# EAGLE board canSlaveV06 (EAGLE 7.1.0)
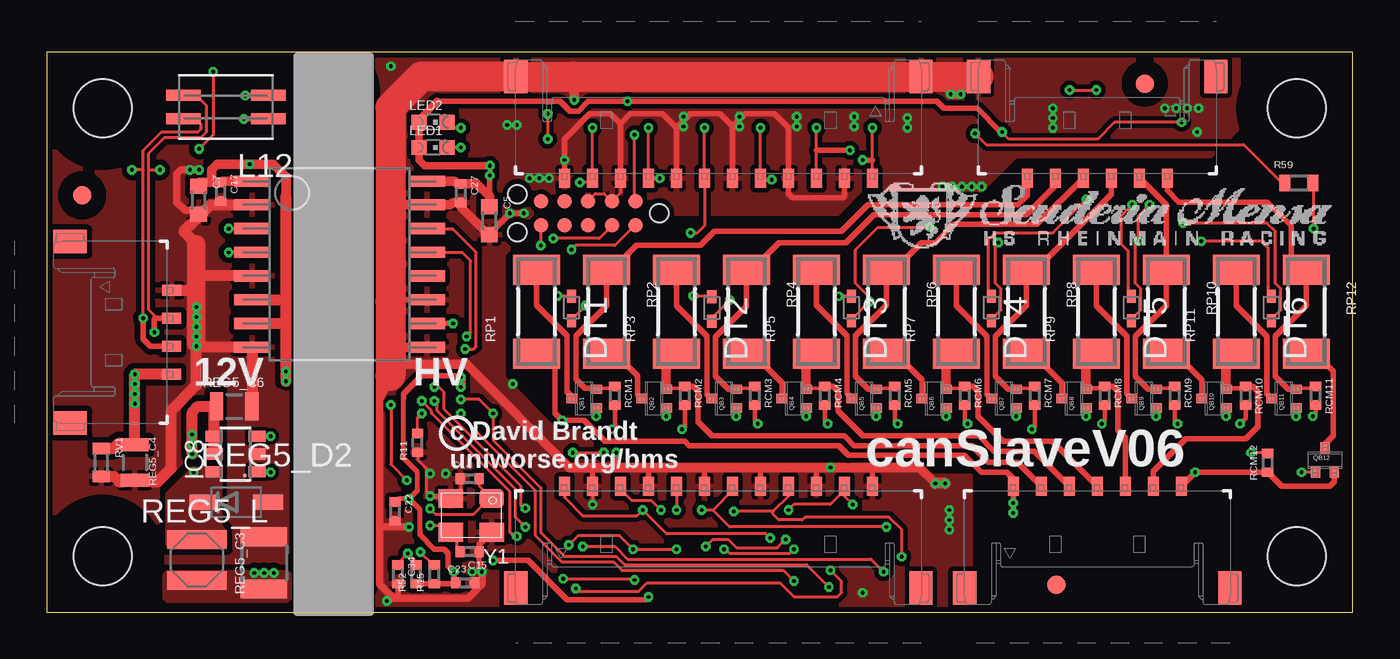
[diagram p7: board, top side]
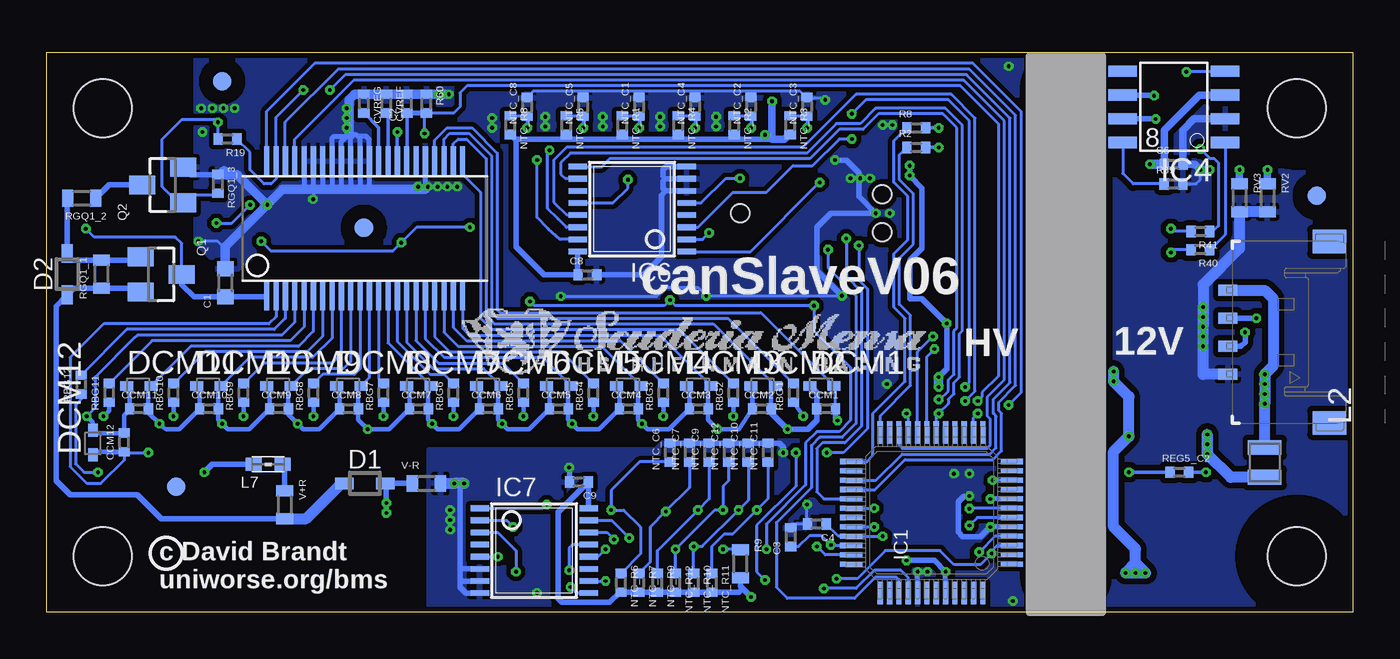
[diagram p8: board, bottom side, seen from below]

Size 70 x 30 mm. Coordinates in mm from the lower left corner, seen from the top.
Outline: 70,0 70,30 0,30 0,0 70,0
Copper layers (1*16): Top 0.035mm / dielectric 1.5mm / Bottom 0.035mm
Design rules "PCB-POOL Standard *": minimum track width 0.15mm, minimum drill 0.2mm, track to track 0.15mm, track to pad 0.15mm, pad to pad 0.15mm, via to via 0.15mm, smd to smd 0mil, copper to edge 0.3mm, drill to drill 0.2mm, minimum pad ring 0.2mm, minimum via ring 0.15mm, stop-mask expansion 0.075mm, vias tented up to drill 0.31mm, thermal gap 0.2mm
Holes 3.1 mm at 3,3 3,27 67,3 67,27
tRestrict: area 0,0 to 6,6; area 0,24 to 6,30; area 64,0 to 70,6; area 64,24 to 70,30; 1 lines
bRestrict: area 0,0 to 6,6; area 0,24 to 6,30; area 64,0 to 70,6; area 64,24 to 70,30; 1 lines

## Footprints (pad centres in the part's own frame; a part is rotated, then mirrored left to right if it is on the bottom)
C0603 = smd 0.8 x 0.9: 1 -0.75,0; 2 0.75,0
C0402 = smd 0.5 x 0.6: 1 -0.5,0; 2 0.5,0
SOD323-L = smd 1 x 0.6: A 1.1,0; C -1.1,0
TC2050-NL-JTORDER = smd 0.787 x 0.787: 1 -2.54,-0.635; 2 -2.54,0.635; 3 -1.27,-0.635; 4 -1.27,0.635; 5 0,-0.635; 6 0,0.635; 7 1.27,-0.635; 8 1.27,0.635; 9 2.54,-0.635; 10 2.54,0.635 | hole 0.991: 3.81,1.016; 3.81,-1.016; -3.81,0
SOD523 = smd 0.7 x 0.5: A 0.65,0; C -0.65,0
FIDUCIAL_1MM = smd 1 x 1: 1 0,0
LQFP48 = smd 0.28 x 1.2: 1 -2.75,-4.3; 2 -2.25,-4.3; 3 -1.75,-4.3; 4 -1.25,-4.3; 5 -0.75,-4.3; 6 -0.25,-4.3; 7 0.25,-4.3; 8 0.75,-4.3; 9 1.25,-4.3; 10 1.75,-4.3; 11 2.25,-4.3; 12 2.75,-4.3; 25 2.75,4.3; 26 2.25,4.3; 27 1.75,4.3; 28 1.25,4.3; 29 0.75,4.3; 30 0.25,4.3; 31 -0.25,4.3; 32 -0.75,4.3; 33 -1.25,4.3; 34 -1.75,4.3; 35 -2.25,4.3; 36 -2.75,4.3 | smd 1.2 x 0.28: 13 4.3,-2.75; 14 4.3,-2.25; 15 4.3,-1.75; 16 4.3,-1.25; 17 4.3,-0.75; 18 4.3,-0.25; 19 4.3,0.25; 20 4.3,0.75; 21 4.3,1.25; 22 4.3,1.75; 23 4.3,2.25; 24 4.3,2.75; 37 -4.3,2.75; 38 -4.3,2.25; 39 -4.3,1.75; 40 -4.3,1.25; 41 -4.3,0.75; 42 -4.3,0.25; 43 -4.3,-0.25; 44 -4.3,-0.75; 45 -4.3,-1.25; 46 -4.3,-1.75; 47 -4.3,-2.25; 48 -4.3,-2.75
44SSOP = smd 1.6 x 0.28: 1 -3.6,5.25; 2 -3.6,4.75; 3 -3.6,4.25; 4 -3.6,3.75; 5 -3.6,3.25; 6 -3.6,2.75; 7 -3.6,2.25; 8 -3.6,1.75; 9 -3.6,1.25; 10 -3.6,0.75; 11 -3.6,0.25; 12 -3.6,-0.25; 13 -3.6,-0.75; 14 -3.6,-1.25; 15 -3.6,-1.75; 16 -3.6,-2.25; 17 -3.6,-2.75; 18 -3.6,-3.25; 19 -3.6,-3.75; 20 -3.6,-4.25; 21 -3.6,-4.75; 22 -3.6,-5.25; 23 3.6,-5.25; 24 3.6,-4.75; 25 3.6,-4.25; 26 3.6,-3.75; 27 3.6,-3.25; 28 3.6,-2.75; 29 3.6,-2.25; 30 3.6,-1.75; 31 3.6,-1.25; 32 3.6,-0.75; 33 3.6,-0.25; 34 3.6,0.25; 35 3.6,0.75; 36 3.6,1.25; 37 3.6,1.75; 38 3.6,2.25; 39 3.6,2.75; 40 3.6,3.25; 41 3.6,3.75; 42 3.6,4.25; 43 3.6,4.75; 44 3.6,5.25
SO-8 = smd 1.524 x 0.61: 1 -2.743,1.905; 2 -2.743,0.635; 3 -2.743,-0.635; 4 -2.743,-1.905; 5 2.743,-1.905; 6 2.743,-0.635; 7 2.743,0.635; 8 2.743,1.905
SO16WB = smd 1.9 x 0.6: P$1 -4.7,4.445; P$2 -4.7,3.175; P$3 -4.7,1.905; P$4 -4.7,0.635; P$5 -4.7,-0.635; P$6 -4.7,-1.905; P$7 -4.7,-3.175; P$8 -4.7,-4.445; P$9 4.7,-4.445; P$10 4.7,-3.175; P$11 4.7,-1.905; P$12 4.7,-0.635; P$13 4.7,0.635; P$14 4.7,1.905; P$15 4.7,3.175; P$16 4.7,4.445
TSSOP16 = smd 0.305 x 0.991: 1 -2.275,-2.918; 2 -1.625,-2.918; 3 -0.975,-2.918; 4 -0.325,-2.918; 5 0.325,-2.918; 6 0.975,-2.918; 7 1.625,-2.918; 8 2.275,-2.918; 9 2.275,2.918; 10 1.625,2.918; 11 0.975,2.918; 12 0.325,2.918; 13 -0.325,2.918; 14 -0.975,2.918; 15 -1.625,2.918; 16 -2.275,2.918
SOT23-6 = smd 0.6 x 0.9: 1 -0.95,-1.15; 2 0,-1.15; 3 0.95,-1.15; 4 0.95,1.15; 5 0,1.15; 6 -0.95,1.15
WE-PMI_0806 = smd 0.8 x 1.8: 1 -0.8,0; 2 0.8,0
0603 = smd 0.85 x 0.7: 1 -0.775,0; 2 0.775,0
WE-SLM = smd 1.85 x 0.6: 1 -2.28,0.63; 2 -2.28,-0.62; 3 2.27,-0.62; 4 2.27,0.63
CHIPLED_0603 = smd 0.8 x 0.8: A 0,-0.75; C 0,0.75
R0402 = smd 0.5 x 0.6: 1 -0.5,0; 2 0.5,0
SOT23 = smd 1 x 1.4: 1 -0.95,-1.1; 2 0.95,-1.1; 3 0,1.1
SOT416 = smd 0.5 x 0.6: 1 -0.5,-0.65; 2 0.5,-0.65; 3 0,0.65
R0603 = smd 0.6 x 0.9: 1 -0.75,0; 2 0.75,0
C1210 = smd 1 x 2.5: 1 -1.4,0; 2 1.4,0
C0805 = smd 0.7 x 1.5: 1 -0.95,0; 2 0.95,0
SOD123 = smd 1.6 x 0.8: 1 -1.7,0; 2 1.7,0
WE-TPC_2828 = smd 3.2 x 1: 1 0,1.1; 2 0,-1.1
MINI_MELF-0207R = smd 1.6 x 2.5: 1 -2.25,0; 2 2.25,0
504050-0791 = smd 0.6 x 1: 1 -4.5,-0.25; 2 -3,-0.25; 3 -1.5,-0.25; 4 0,-0.25; 5 1.5,-0.25; 6 3,-0.25; 7 4.5,-0.25 | smd 1.25 x 1.8: P1 -7.105,5.2; P2 7.105,5.2
504050-0691 = smd 0.6 x 1: 1 -3.75,-0.25; 2 -2.25,-0.25; 3 -0.75,-0.25; 4 0.75,-0.25; 5 2.25,-0.25; 6 3.75,-0.25 | smd 1.25 x 1.8: P1 -6.355,5.2; P2 6.355,5.2
504050-0491 = smd 0.6 x 1: 1 -2.25,-0.25; 2 -0.75,-0.25; 3 0.75,-0.25; 4 2.25,-0.25 | smd 1.25 x 1.8: P1 -4.855,5.2; P2 4.855,5.2
504050-1291 = smd 0.6 x 1: 1 -8.25,-0.25; 2 -6.75,-0.25; 3 -5.25,-0.25; 4 -3.75,-0.25; 5 -2.25,-0.25; 6 -0.75,-0.25; 7 0.75,-0.25; 8 2.25,-0.25; 9 3.75,-0.25; 10 5.25,-0.25; 11 6.75,-0.25; 12 8.25,-0.25 | smd 1.25 x 1.8: P1 -10.855,5.2; P2 10.855,5.2
MT = smd 1.3 x 1: P1 -1.1,-0.9; P2 1.1,-0.9; P3 1.1,0.9; P4 -1.1,0.9

## Placement (x,y rotation side)
C1  100n,100V  [C0603]  60.42,17.64 90 bottom
C2  100n  [C0402]  50.7,27.25 90 bottom
C3  100n  [C0402]  30.12,4.03 90 bottom
C4  100n  [C0402]  28.73,4.72 180 bottom
C5  10u,10V,X7R  [C0603]  23.73,20.98 270 top
C6  100n,>10V,X7R  [C0402]  9.6,24 0 bottom
C7  10u,10V,X7R  [C0603]  8.15,22.07 270 top
C8  100n,>10V,X7R  [C0402]  41.02,18.07 0 bottom
C9  100n,>10V,X7R  [C0402]  41.48,6.97 180 bottom
C14  10p  [C0402]  22.68,7.15 0 top
C15  10p  [C0402]  22.68,3.25 180 top
C17  100n,>10V,X7R  [C0402]  9.32,22.52 270 top
C22  100n  [C0402]  18.68,5.4 270 top
C23  100n  [C0402]  22.43,1.57 0 top
C27  100n,>10V,X7R  [C0402]  22.2,22.45 270 top
C34  100n  [C0402]  18.82,2.02 270 top
CCM1  100n  [C0402]  28.23,10.9 0 bottom
CCM2  100n  [C0402]  31.68,10.9 0 bottom
CCM3  100n  [C0402]  35.05,10.9 0 bottom
CCM4  100n  [C0402]  38.8,10.9 0 bottom
CCM5  100n  [C0402]  42.55,10.9 0 bottom
CCM6  100n  [C0402]  46.3,10.9 0 bottom
CCM7  100n  [C0402]  50.05,10.9 0 bottom
CCM8  100n  [C0402]  53.8,10.9 0 bottom
CCM9  100n  [C0402]  57.55,10.9 0 bottom
CCM10  100n  [C0402]  61.3,10.9 0 bottom
CCM11  100n  [C0402]  65.05,10.9 0 bottom
CCM12  100n  [C0402]  65.85,9.1 90 bottom
CVREF  1u  [C0402]  51.8,27.25 270 bottom
CVREG  1u  [C0402]  53,27.25 270 bottom
D1  51V  [SOD323-L]  52.95,6.9 0 bottom
D2  12V  [SOD323-L]  68.89,18.11 90 bottom
DBG1  JTAG10-TC2050-NL  [TC2050-NL-JTORDER]  29.02,21.38 180 top
DCM1  7.5  [SOD523]  28.45,12.12 0 bottom
DCM2  7.5  [SOD523]  31.6,12.12 0 bottom
DCM3  7.5  [SOD523]  35.05,12.12 0 bottom
DCM4  7.5  [SOD523]  38.8,12.12 0 bottom
DCM5  7.5  [SOD523]  42.55,12.12 0 bottom
DCM6  7.5  [SOD523]  46.3,12.12 0 bottom
DCM7  7.5  [SOD523]  50.05,12.12 0 bottom
DCM8  7.5  [SOD523]  53.8,12.12 0 bottom
DCM9  7.5  [SOD523]  57.55,12.12 0 bottom
DCM10  7.5  [SOD523]  61.3,12.12 0 bottom
DCM11  7.5  [SOD523]  65.05,12.12 0 bottom
DCM12  7.5  [SOD523]  67.53,9.1 90 bottom
DT1  1PS79SB40  [SOD523]  28.12,16.27 270 top
DT2  1PS79SB40  [SOD523]  35.65,16.25 270 top
DT3  1PS79SB40  [SOD523]  43.12,16.27 270 top
DT4  1PS79SB40  [SOD523]  50.62,16.27 270 top
DT5  1PS79SB40  [SOD523]  58.12,16.27 270 top
DT6  1PS79SB40  [SOD523]  65.62,16.27 270 top
FID2  FIDUCIAL""  [FIDUCIAL_1MM]  1.91,22.33 0 top
FID3  FIDUCIAL""  [FIDUCIAL_1MM]  54.12,1.49 0 top
FID4  FIDUCIAL""  [FIDUCIAL_1MM]  58.85,28.32 0 top
FID7  FIDUCIAL""  [FIDUCIAL_1MM]  60.6,28.45 0 bottom
FID8  FIDUCIAL""  [FIDUCIAL_1MM]  1.95,22.31 0 bottom
FID9  FIDUCIAL""  [FIDUCIAL_1MM]  53,20.6 0 bottom
FID10  FIDUCIAL""  [FIDUCIAL_1MM]  63.05,6.72 0 bottom
IC1  LPC11C14  [LQFP48]  22.57,5.33 90 bottom
IC2  LTC6803-4  [44SSOP]  52.96,20.57 90 bottom
IC4  PCA82C251  [SO-8]  9.59,27.07 180 bottom
IC5  ADUM5201  [SO16WB]  15.7,18.65 0 top
IC6  4052-TSSOP16  [TSSOP16]  38.62,21.6 90 bottom
IC7  4052-TSSOP16  [TSSOP16]  43.88,3.3 270 bottom
IC8  LMR14203  [SOT23-6]  10.12,8.47 90 top
L2  WE-PMI/74479776233A  [WE-PMI_0806]  4.72,8.03 270 bottom
L7  WE-CBF,742792664  [0603]  58.13,7.92 0 bottom
L12  744242101  [WE-SLM]  9.6,27.07 180 top
LED1  GRN  [CHIPLED_0603]  20.7,24.9 270 top
LED2  RED  [CHIPLED_0603]  20.7,26.25 270 top
NTC_C1  1u  [C0402]  38.25,27.07 90 bottom
NTC_C2  1u  [C0402]  32.25,27.07 90 bottom
NTC_C3  1u  [C0402]  29.25,27.07 90 bottom
NTC_C4  1u  [C0402]  35.25,27.07 90 bottom
NTC_C5  1u  [C0402]  41.25,27.07 90 bottom
NTC_C6  1u  [C0402]  36.6,8.55 90 bottom
NTC_C7  1u  [C0402]  35.55,8.55 90 bottom
NTC_C8  1u  [C0402]  44.25,27.07 90 bottom
NTC_C9  1u  [C0402]  34.5,8.55 90 bottom
NTC_C10  1u  [C0402]  32.4,8.55 90 bottom
NTC_C11  1u  [C0402]  31.35,8.55 90 bottom
NTC_C12  1u  [C0402]  33.45,8.55 90 bottom
NTC_R1  10k  [R0402]  39.15,26.1 270 bottom
NTC_R2  10k  [R0402]  33.15,26.1 270 bottom
NTC_R3  10k  [R0402]  30.15,26.1 270 bottom
NTC_R4  10k  [R0402]  36.15,26.1 270 bottom
NTC_R5  10k  [R0402]  42.15,26.1 270 bottom
NTC_R6  10k  [R0402]  39.23,1.57 270 bottom
NTC_R7  10k  [R0402]  38.25,1.57 270 bottom
NTC_R8  10k  [R0402]  45.15,26.1 270 bottom
NTC_R9  10k  [R0402]  37.27,1.57 270 bottom
NTC_R10  10k  [R0402]  35.33,1.57 270 bottom
NTC_R11  10k  [R0402]  34.35,1.57 270 bottom
NTC_R12  10k  [R0402]  36.3,1.57 270 bottom
Q1  BSS84  [SOT23]  63.86,18.1 270 bottom
Q2  2N7002  [SOT23]  63.78,22.89 90 bottom
QB1  BSS84AKT  [SOT416]  28.8,11.45 90 top
QB2  BSS84AKT  [SOT416]  32.55,11.45 90 top
QB3  BSS84AKT  [SOT416]  36.3,11.45 90 top
QB4  BSS84AKT  [SOT416]  40.05,11.45 90 top
QB5  BSS84AKT  [SOT416]  43.8,11.45 90 top
QB6  BSS84AKT  [SOT416]  47.55,11.45 90 top
QB7  BSS84AKT  [SOT416]  51.3,11.45 90 top
QB8  BSS84AKT  [SOT416]  55.05,11.45 90 top
QB9  BSS84AKT  [SOT416]  58.8,11.45 90 top
QB10  BSS84AKT  [SOT416]  62.55,11.45 90 top
QB11  BSS84AKT  [SOT416]  66.3,11.45 90 top
QB12  BSS84AKT  [SOT416]  68.5,8.15 0 top
R2  1k  [R0402]  23.4,24.9 0 bottom
R8  1k  [R0402]  23.4,25.95 0 bottom
R9  3.3k  [R0603]  32.83,2.6 270 bottom
R11  10k  [R0402]  19.88,9.07 90 top
R15  10k  [R0402]  20.77,2.02 90 top
R19  4.7k  [R0402]  60.31,25.35 180 bottom
R39  0  [R0402]  9.61,22.95 0 bottom
R40  100  [R0402]  8.18,19.43 180 bottom
R41  100  [R0402]  8.18,20.4 180 bottom
R52  10k  [R0402]  19.8,2.02 90 top
R59  332k0.1%  [R0603]  67.1,23 0 top
R60  20k0.1%  [R0402]  49.65,27.25 270 bottom
RBG1  3.3k  [R0402]  29.98,11.75 90 bottom
RBG2  3.3k  [R0402]  33.2,11.75 90 bottom
RBG3  3.3k  [R0402]  36.95,11.75 90 bottom
RBG4  3.3k  [R0402]  40.7,11.75 90 bottom
RBG5  3.3k  [R0402]  44.45,11.75 90 bottom
RBG6  3.3k  [R0402]  48.2,11.75 90 bottom
RBG7  3.3k  [R0402]  51.95,11.75 90 bottom
RBG8  3.3k  [R0402]  55.7,11.75 90 bottom
RBG9  3.3k  [R0402]  59.45,11.75 90 bottom
RBG10  3.3k  [R0402]  63.2,11.75 90 bottom
RBG11  3.3k  [R0402]  66.65,11.75 90 bottom
RBG12  3.3k  [R0402]  68.15,12.2 90 bottom
RCM1  100  [R0402]  30.45,11.6 270 top
RCM2  100  [R0402]  34.2,11.6 270 top
RCM3  100  [R0402]  37.95,11.6 270 top
RCM4  100  [R0402]  41.7,11.6 270 top
RCM5  100  [R0402]  45.45,11.6 270 top
RCM6  100  [R0402]  49.2,11.6 270 top
RCM7  100  [R0402]  52.95,11.6 270 top
RCM8  100  [R0402]  56.7,11.6 270 top
RCM9  100  [R0402]  60.45,11.6 270 top
RCM10  100  [R0402]  64.25,11.6 270 top
RCM11  100  [R0402]  68,11.6 270 top
RCM12  100  [R0402]  65.42,8 90 top
REG5_C2  100n,>=25V,>=X5R  [C0402]  9.3,7.5 0 bottom
REG5_C3  47u,10V,X7R  [C1210]  11.65,2.65 90 top
REG5_C4  2.2u,50V,X7R  [C0805]  4.72,8.03 270 top
REG5_C6  2.2u,50V,X7R  [C0805]  10.05,11.03 0 top
REG5_D2  PMEG6010CEH  [SOD123]  10.18,5.9 0 top
REG5_L  744025100  [WE-TPC_2828]  8.05,2.8 0 top
RGQ1_1  1M,50V  [R0603]  67.07,18.11 90 bottom
RGQ1_2  100k,50V  [R0603]  68.11,22.18 180 bottom
RGQ1_3  1M  [R0402]  60.83,22.95 270 bottom
RP1  22  [MINI_MELF-0207R]  26.25,16.1 90 top
RP2  22  [MINI_MELF-0207R]  30,16.1 270 top
RP3  22  [MINI_MELF-0207R]  33.75,16.1 90 top
RP4  22  [MINI_MELF-0207R]  37.5,16.1 270 top
RP5  22  [MINI_MELF-0207R]  41.25,16.1 90 top
RP6  22  [MINI_MELF-0207R]  45,16.1 270 top
RP7  22  [MINI_MELF-0207R]  48.75,16.1 90 top
RP8  22  [MINI_MELF-0207R]  52.5,16.1 270 top
RP9  22  [MINI_MELF-0207R]  56.25,16.1 90 top
RP10  22  [MINI_MELF-0207R]  60,16.1 270 top
RP11  22  [MINI_MELF-0207R]  63.75,16.1 90 top
RP12  22  [MINI_MELF-0207R]  67.5,16.1 270 top
RV1  24V  [R0603]  2.92,8.03 270 top
RV2  24V  [R0603]  4.58,22.2 270 bottom
RV3  24V  [R0603]  6.08,22.2 270 bottom
U$3  [SMLOGOS_BSILK]  44.8,14.47 0 top
U$4  [SMLOGOS_SILK]  46.95,21.23 0 top
V+R  100  [R0603]  57.24,5.77 270 bottom
V-R  100  [R0603]  49.65,6.9 0 bottom
X1  504050-0791  [504050-0791]  56.3,6.5 180 top
X2  504050-0691  [504050-0691]  56.3,23.5 0 top
X3  504050-0491  [504050-0491]  6.45,15 90 top
X4  504050-0491  [504050-0491]  6.45,15 270 bottom
X5  504050-1291  [504050-1291]  36,23.5 0 top
X6  504050-1291  [504050-1291]  36,6.5 180 top
Y1  12Mhz  [MT]  22.75,5.19 180 top

## Tracks (layer width: path | path; a pad name or v marks a point on that pad's centre or on a via)
!RESET  (via drill 0.2)
  Top 0.15: C34.1 18.82,2.62 v19.35,3.15 19.8,2.7 R52.2 | DBG1.10 26.48,20.77 v26.48,19.65 | v28.2,8.55 v29.85,8.55 | v27.68,1.8 31.43,1.8 v31.5,1.73
  Bottom 0.15: IC1.3 19.07,3.58 19.35,3.3 v19.35,3.15 19.95,2.55 21.38,2.55 22.12,3.3 25.05,3.3 26.55,1.8 v27.68,1.8 | v26.48,19.65 26.48,17.77 26.02,17.32 26.02,9.82 27.3,8.55 v28.2,8.55 | v29.85,8.55 29.85,6.75 31.95,4.65 31.95,2.17 v31.5,1.73
+3V3  (via drill 0.2)
  Top 0.15: v60.83,26.25 57.23,26.25 56.33,25.35 51.58,25.35 v51.2,25.73 | DBG1.1 31.57,22.06 31.5,22.12 v31.5,25.57
  Top 0.27: v19.43,6.08 18.85,6.08 C22.1 | 21.82,1.68 C23.1 | 20,4.25 20,5.5 v19.43,6.08 | v19.43,6.08 19.88,6.53 19.88,7.5 19.12,8.25 19.12,11.47
  Top 0.3: v21.77,15.47 IC5.P$10 | v23.75,23.93 v23.75,23.4 23.73,23.3 C5.1 | v51.2,25.73 51.15,25.73 49.88,27 48.08,27 47.7,27.38 v31.12,27.38 29.02,27.38 28.5,26.85 28.05,26.85 27.52,27.38 20.93,27.38 | 19.12,11.47 19.12,11.7 20.1,12.68 22.12,12.68 v22.2,12.6 | 21.82,1.68 v21.82,2.17 21.52,2.48 21.52,3.15 21.3,3.38 20.77,3.38 20,4.15 20,4.25 | C23.1 21.88,1.52 R15.1 R52.1 | v23.93,2.77 25.8,2.77 27.9,0.68 32.1,0.68 v32.25,0.82
  Top 0.4: v23.75,23.93 20.25,23.93 19.95,24.23 LED1.A LED2.A 20,26.45 20.93,27.38
  Top 0.5: IC5.P$16 20.48,23.1 21.85,23.1 22,22.95 C27.1 23.05,22.95 23.73,22.27 C5.1 | v22.2,12.6 v22.2,12.07
  Bottom 0.15: RGQ1_3.2 60.85,22.45 60.95,22.35 62.28,22.35 Q2.1 62.94,21.94 63.8,22.8 63.8,25.35 62.75,26.4 60.98,26.4 v60.83,26.25 60.81,26.23 R19.2 | NTC_R3.2 30.2,25.6 30.38,25.43 | 44.9,25.35 NTC_R8.2 | NTC_R5.2 42.15,25.5 42.3,25.35 | NTC_R1.2 39.15,25.43 39.08,25.35 | NTC_R4.2 36.15,25.35 | NTC_R2.2 33.15,25.35 | 31.12,25.35 31.27,25.35 v31.5,25.57
  Bottom 0.2: IC2.30 51.21,25.57 v51.2,25.73 | 41.54,18.09 C8.1
  Bottom 0.27: IC1.8 v19.43,6.08 | IC1.44 v21.82,2.17
  Bottom 0.3: v22.2,12.6 21.75,13.05 21.75,15.45 v21.77,15.47 23.1,16.8 23.75,16.8 23.75,18.85 23.1,19.5 23.1,22.73 23.75,23.38 v23.75,23.4 v23.75,23.93 | v21.82,2.17 22.43,2.77 v23.93,2.77 | 31.12,25.35 33.15,25.35 36.15,25.35 39.08,25.35 42.3,25.35 44.9,25.35 | IC6.16 41.54,18.09 | C8.1 43.35,18.07 44.85,19.57 44.85,25.3 NTC_R8.2 | v32.25,0.82 32.7,1.27 | 32.7,1.27 32.83,1.4 R9.2 | IC7.16 40.96,5.92 40.95,5.92 40.95,6.95 C9.1 42.6,5.35 42.6,0.75 42.38,0.53 39.83,0.53 39.27,1.07 NTC_R6.2 NTC_R9.2 NTC_R7.2 NTC_R12.2 NTC_R10.2 NTC_R11.2 32.9,1.07 32.7,1.27
  Bottom 0.4: 30.38,25.43 30.45,25.35 31.12,25.35 v31.12,27.38
  Bottom 0.5: v22.2,12.07 v22.2,12.6
BAL1
  Bottom 0.15: IC2.25 48.71,25.34 48.4,25.65 47.35,25.65 46.15,24.45 46.15,16.05 45.85,15.75 33.48,15.75 RBG1.2
BAL2
  Bottom 0.15: IC2.23 47.71,23.46 46.75,22.5 46.75,15.75 46.15,15.15 36.1,15.15 RBG2.2
BAL3
  Bottom 0.15: IC2.21 48.21,15.26 47.5,14.55 39.25,14.55 RBG3.2
BAL4
  Bottom 0.15: IC2.19 49.21,14.76 48.4,13.95 42.4,13.95 RBG4.2
BAL5
  Bottom 0.15: IC2.17 50.21,14.56 49,13.35 45.55,13.35 RBG5.2
BAL6
  Bottom 0.15: IC2.15 51.21,14.51 49.45,12.75 48.7,12.75 RBG6.2
BAL7
  Bottom 0.15: IC2.13 52.21,12.51 RBG7.2
BAL8
  Bottom 0.15: IC2.11 53.21,13.04 53.5,12.75 55.2,12.75 RBG8.2
BAL9
  Bottom 0.15: IC2.9 54.21,13.84 54.7,13.35 58.35,13.35 RBG9.2
BAL10
  Bottom 0.15: IC2.7 55.21,14.79 56.05,13.95 61.5,13.95 RBG10.2
BAL11
  Bottom 0.15: IC2.5 56.21,15.29 56.95,14.55 64.35,14.55 RBG11.2
BAL12
  Bottom 0.15: IC2.3 57.21,15.74 57.8,15.15 65.7,15.15 RBG12.2
BOOST1  (via drill 0.2)
  Top 0.2: v12,7.5 11.3,7.5 IC8.1
  Bottom 0.2: REG5_C2.1 v12,7.5
C0  (via drill 0.2)
  Top 0.3: RP1.1 26.75,13.85 27.25,13.35 27.25,10.65 v27.62,10.28 28.8,10.28 29.93,9.15 34.2,9.15 34.42,8.93 42.45,8.93 42.98,8.4 49.2,8.4 50.1,7.5 51.45,7.5 51.8,7.15 X1.7 v51.8,5.85 v51.8,5.33
  Bottom 0.15: IC2.26 49.21,25.29 48.55,25.95 47.2,25.95 45.85,24.6 45.85,16.2 45.7,16.05 31.73,16.05 DCM1.A 27.73,12.05 CCM1.2
  Bottom 0.3: V-R.1 D1.A 51.8,6.85 v51.8,5.33 | CCM1.2 27.73,10.38 v27.62,10.28
C1
  Top 0.2: QB1.2 29.5,12 30.35,12 RCM1.1
  Top 0.3: RP2.1 30.3,18.35 31.6,19.65 35.05,19.65 35.8,20.4 42.6,20.4 44.02,21.82 52.05,21.82 52.55,22.32 X2.1 | RP2.1 30,17.9 | 29.5,12 28.85,12 28.38,12.47 28.38,14.8 30,16.43 RP2.1
C1M  (via drill 0.2)
  Top 0.25: RCM1.2 30.45,9.95 v30.3,9.8
  Bottom 0.15: IC2.24 48.21,25.09 47.95,25.35 47.5,25.35 46.45,24.3 46.45,15.9 46,15.45 34.27,15.45 DCM2.A
  Bottom 0.25: CCM2.2 31.18,11.97 DCM2.A
  Bottom 0.3: CCM2.2 31.18,10.68 v30.3,9.8 29.2,9.8 28.73,10.28 CCM1.1 28.73,11.75 DCM1.C
C2
  Top 0.2: QB2.2 33.25,12 34.1,12 RCM2.1
  Top 0.3: RCM2.1 34.65,12.1 34.9,11.85 34.9,10.2 35.65,9.45 42.75,9.45 43.27,8.93 49.58,8.93 50.48,8.03 52.02,8.03 X1.6
  Top 0.5: QB2.2 33.2,13.3 RP3.1
C2M  (via drill 0.2)
  Top 0.25: RCM2.2 34.2,9.95 v34.05,9.8
  Bottom 0.15: IC2.22 47.71,15.21 47.35,14.85 37.12,14.85 DCM3.A
  Bottom 0.25: DCM2.C 32.17,12.05 CCM2.1 32.9,9.8 v34.05,9.8 34.55,10.3 CCM3.2 34.55,11.97 DCM3.A
C3
  Top 0.2: QB3.2 37,12 37.85,12 RCM3.1
  Top 0.3: QB3.2 36.55,11.95 35.85,12.65 35.85,14.75 37.5,16.4 RP4.1 37.8,18.35 39.25,19.8 42.83,19.8 44.33,21.3 52.5,21.3 54.05,22.85 X2.2
C3M  (via drill 0.2)
  Top 0.25: RCM3.2 37.95,10.25 v38.1,10.1
  Bottom 0.15: IC2.20 48.71,15.01 47.95,14.25 40.27,14.25 DCM4.A
  Bottom 0.25: DCM3.C 35.55,11.97 CCM3.1 36.65,9.8 37.8,9.8 v38.1,10.1 38.3,10.3 CCM4.2 38.3,11.97 DCM4.A
C4
  Top 0.2: QB4.2 40.65,11.95 40.6,12 41.6,12 RCM4.1
  Top 0.3: RCM4.1 42.15,12.1 42.4,11.85 42.4,10.8 43.75,9.45 49.95,9.45 50.77,8.62 52.92,8.62 X1.5
  Top 0.5: QB4.2 40.7,13.3 RP5.1
C4M  (via drill 0.2)
  Top 0.25: RCM4.2 41.7,10.25 v41.85,10.1
  Bottom 0.15: IC2.18 49.71,14.66 48.7,13.65 43.42,13.65 DCM5.A
  Bottom 0.25: DCM4.C 39.3,11.97 CCM4.1 40.4,9.8 41.55,9.8 v41.85,10.1 42.05,10.3 CCM5.2 42.05,11.97 DCM5.A
C5
  Top 0.2: QB5.2 44.5,12 45.35,12 RCM5.1
  Top 0.3: QB5.2 44.05,11.95 43.35,12.65 43.35,14.8 45,16.45 RP6.1 45.45,18.35 45.45,18.38 46.88,19.8 47.62,19.8 48.6,20.77 53.08,20.77 X2.3
C5M  (via drill 0.2)
  Top 0.25: RCM5.2 45.45,10.25 v45.6,10.1
  Bottom 0.15: IC2.16 50.71,14.46 49.3,13.05 46.58,13.05 DCM6.A
  Bottom 0.25: DCM5.C 43.05,11.97 CCM5.1 44.15,9.8 45.3,9.8 v45.6,10.1 45.8,10.3 CCM6.2 45.8,11.97 DCM6.A
C6
  Top 0.2: QB6.2 48.25,12 49.1,12 RCM6.1
  Top 0.3: RCM6.1 49.65,12.1 49.9,11.85 49.9,10.5 51.25,9.15 53.9,9.15 X1.4
  Top 0.5: QB6.2 48.2,13.3 RP7.1
C6M  (via drill 0.2)
  Top 0.25: RCM6.2 49.2,10.25 v49.35,10.1
  Bottom 0.15: IC2.14 51.71,14.43 DCM7.A
  Bottom 0.25: DCM6.C 46.8,11.97 CCM6.1 47.9,9.8 49.05,9.8 v49.35,10.1 49.55,10.3 CCM7.2 49.55,11.97 DCM7.A
C7
  Top 0.2: QB7.2 52,12 52.85,12 RCM7.1
  Top 0.3: QB7.2 51.55,11.95 50.85,12.65 50.85,14.78 52.5,16.43 RP8.1 53,18.35 57.05,22.4 X2.4
C7M  (via drill 0.2)
  Top 0.25: RCM7.2 52.95,9.95 v52.8,9.8
  Bottom 0.15: IC2.12 52.71,12.57 DCM8.A
  Bottom 0.25: DCM7.C 50.55,11.97 CCM7.1 51.65,9.8 v52.8,9.8 53.3,10.3 CCM8.2 53.3,11.97 DCM8.A
C8
  Top 0.25: QB8.2 55.75,12 56.6,12 RCM8.1
  Top 0.3: RCM8.1 57.15,12.1 57.4,11.85 57.4,9.75 57.8,9.35 X1.3
  Top 0.5: QB8.2 55.7,13.3 RP9.1
C8M  (via drill 0.2)
  Top 0.25: RCM8.2 56.7,10.25 v56.55,10.1
  Bottom 0.15: IC2.10 53.71,13.44 54.1,13.05 55.98,13.05 DCM9.A
  Bottom 0.25: DCM8.C 54.3,11.97 CCM8.1 55.4,9.8 56.25,9.8 v56.55,10.1 57.05,10.6 CCM9.2 57.05,11.97 DCM9.A
C9
  Top 0.2: QB9.2 59.5,12 60.35,12 RCM9.1
  Top 0.3: QB9.2 59.05,11.95 58.35,12.65 58.35,14.78 60,16.43 RP10.1 60,21.82 58.58,23.25 X2.5
C9M  (via drill 0.2)
  Top 0.25: RCM9.2 60.45,10.25 v60.6,10.1
  Bottom 0.15: IC2.8 54.71,14.69 55.75,13.65 59.12,13.65 DCM10.A
  Bottom 0.25: DCM9.C 58.05,11.97 CCM9.1 59.15,9.8 60.3,9.8 v60.6,10.1 60.8,10.3 CCM10.2 60.8,11.97 DCM10.A
C10
  Top 0.25: RCM10.1 64.15,12 63.25,12 QB10.2
  Top 0.3: RCM10.1 64.65,12.1 64.9,11.85 64.9,9.9 64.88,9.9 64.28,9.3 61.05,9.3 59.3,7.55 X1.2
  Top 0.5: QB10.2 63.2,13.3 RP11.1
C10M  (via drill 0.2)
  Top 0.25: RCM10.2 64.25,10.4 v63.95,10.1
  Bottom 0.15: IC2.6 55.71,15.04 56.5,14.25 62.27,14.25 DCM11.A
  Bottom 0.25: DCM10.C 61.8,11.97 CCM10.1 62.9,9.8 63.6,9.8 64,10.05 v63.95,10.1 64.55,10.7 CCM11.2 64.55,11.97 DCM11.A
C11
  Top 0.2: QB11.2 67,12 67.9,12 RCM11.1
  Top 0.3: QB11.2 66.55,11.95 65.85,12.65 65.85,14.78 67.5,16.43 RP12.1 67.1,18.35 66.7,18.75 66.7,20.7 65.42,21.98 60.67,21.98 60.05,22.6 X2.6
C11M  (via drill 0.2)
  Top 0.25: RCM11.2 68,10.65 v67.85,10.5
  Bottom 0.15: IC2.4 56.71,15.54 57.4,14.85 65.12,14.85 65.28,14.72 67.4,12.6 67.4,10.95 v67.85,10.5
  Bottom 0.25: DCM11.C 65.55,11.97 CCM11.1 65.6,10.9 65.6,10.8 65.85,10.55 CCM12.2 67.38,9.6 DCM12.A 67.53,10.18 v67.85,10.5
C12  (via drill 0.2)
  Top 0.3: QB12.2 69,7 68.75,6.75 66.2,6.75 65.45,7.5 RCM12.1 v61.55,7.5 X1.1
  Bottom 0.3: L7.1 61.13,7.92 v61.55,7.5
C12FILT
  Bottom 0.3: V+R.1 57.24,7.81 L7.2
C12M  (via drill 0.2)
  Top 0.15: RCM12.2 65.55,8.5 65.6,8.55 v64.55,8.55
  Bottom 0.15: IC2.2 57.71,15.84 58.1,15.45 66.95,15.45 68.75,13.65 68.75,7.8 67.85,6.9 67.1,6.9 65.85,8.15 CCM12.1 65.9,8.6 65.95,8.55 | 66.8,8.55 65.95,8.55 | 65.95,8.55 v64.55,8.55
  Bottom 0.25: CCM12.1 67.38,8.6 DCM12.C
CANH  (via drill 0.2)
  Top 0.15: L12.4 7.98,26.45 8.25,26.18 8.25,25.88 8.1,25.73 6.15,25.73 5.17,24.75 5.17,23.7 | v5.17,15.75 5.17,23.7 | 5.17,23.7 v4.58,23.7
  Top 0.3: X3.2 5.55,14.25 5.17,14.62 v5.17,15.75
  Bottom 0.3: X4.2 v5.17,15.75
  Bottom 0.4: RV2.1 v4.58,23.7
CANL  (via drill 0.2)
  Top 0.15: L12.3 8.01,27.7 8.55,27.15 8.55,25.73 8.25,25.43 6.3,25.43 5.47,24.6 5.47,23.7 | 5.78,15.68 5.78,15.9 5.47,16.2 5.47,23.7 | 5.47,23.7 5.78,23.7 v6.08,23.7
  Top 0.3: X3.3 5.85,15.75 5.78,15.68 v5.78,15
  Bottom 0.3: X4.3 6,14.25 5.78,14.47 v5.78,15
  Bottom 0.4: RV3.1 v6.08,23.7
CANRX  (via drill 0.2)
  Top 0.15: v22.43,14.1 22.88,14.1 23.02,14.25 23.02,19.27 21.75,20.55 IC5.P$14
  Bottom 0.15: IC1.19 22.82,13.7 v22.43,14.1
CANTX  (via drill 0.2)
  Top 0.15: v22.5,14.78 22.73,15 22.73,18.82 22.27,19.29 IC5.P$13
  Bottom 0.15: IC1.20 23.32,13.95 v22.5,14.78
CAR+5V  (via drill 0.2)
  Top 0.15: IC8.3 v12,9.43
  Top 0.5: IC5.P$1 9.39,23.09 C17.1 8.78,23.02 | C7.1 8.15,23 8.18,23.02 8.78,23.02 | 12.82,22.27 12.82,23.32 12.15,24 v10.88,24 9.15,24 8.85,23.7 8.85,23.1 8.78,23.02
  Top 0.6: v12.82,12.38 12.82,15.45 | 12.82,15.45 12.82,16.8 | 12.82,16.8 12.82,22.27 | IC5.P$7 12.8,15.47 12.82,15.45 | IC5.P$6 12.77,16.75 12.82,16.8
  Bottom 0.4: C6.1 10.1,25.82 8.21,27.71 IC4.3
  Bottom 0.5: C6.1 v10.88,24
  Bottom 0.6: v11.12,2.1 v11.65,2.1 | v11.65,2.1 v12.18,2.1 12.18,2.12 11.65,2.65 | 11.65,2.65 11.1,2.1 v11.65,2.1 | v11.65,2.1 11.65,2.65 | 11.65,2.65 11.65,3.4 12.82,4.58 12.82,8.6 v12,9.43 12,11.55 v12.82,12.38 v12.82,12.9
  pour Top (rank 4, no thermals): 6.3,2.02 6.45,2.17 12.9,2.17 13.05,2.02 13.05,0.75 12.9,0.6 6.45,0.6 6.3,0.75
CAR_CANRX  (via drill 0.2)
  Top 0.15: IC5.P$3 10.51,20.55 10.5,20.55 v9.75,20.55
  Bottom 0.15: R41.2 9.6,20.4 v9.75,20.55
CAR_CANRX_T  (via drill 0.2)
  Top 0.15: v8.93,28.95 8.93,25.57 v8.18,24.82
  Bottom 0.15: IC4.4 7.32,28.98 7.35,28.95 v8.93,28.95 | R41.1 7.5,20.4 7.2,20.7 7.2,24.07 7.42,24.3 7.65,24.3 v8.18,24.82
CAR_CANTX  (via drill 0.2)
  Top 0.15: IC5.P$4 10.73,19.29 10.72,19.27 v9.75,19.27
  Bottom 0.15: R40.2 9.6,19.43 v9.75,19.27
CAR_CANTX_T
  Bottom 0.15: IC4.1 6.85,20.23 7.65,19.43 R40.1
CARGND  (via drill 0.2)
  Top 0.15: C17.2 9.32,21.93 9.22,21.82
  Top 0.4: 8.25,21.3 8.22,21.32 C7.2 7.95,21.52 7.42,21.52 6.97,21.98 6.97,23.48 7.2,23.7 v8.18,23.7 v7.67,23.7
  Top 0.6: IC5.P$2 9.22,21.82 8.78,21.82 8.25,21.3 7.35,20.4 8.03,19.73 | IC5.P$5 8.04,18.02 8.03,18 | 8.03,14.4 8.22,14.21 IC5.P$8 11,11.12 REG5_C6.2 | X3.4 8.03,17.25 8.03,16.88 | v8.03,15.82 v8.03,14.25 8.03,12.15 6.67,10.8 6.67,7.72 5.92,6.97 REG5_C4.2 3.9,6.97 3.6,7.28 RV1.2
  Top 1: 8.03,14.4 v8.03,14.78 v8.03,15.3 v8.03,15.82 v8.03,16.35 8.03,16.88 8.03,18 8.03,19.73
  Bottom 0.15: R39.2 8.4,22.95 8.18,23.18 v8.18,23.7
  Bottom 0.4: IC4.2 8.51,26.44 9.12,25.82 9.12,24.02 C6.2 8.47,24 v8.18,23.7 v7.67,23.7
  Bottom 0.6: X4.4 8.03,12.75 v8.03,15.3 | v8.03,15.3 v8.03,16.35 | RV2.2 RV3.2 6.08,19.5 8.03,17.55 v8.03,15.3
  pour Top (isolate 0.2, rank 6, no thermals): 13.12,11.85 13.05,11.93 9.82,11.93 9.75,11.85 9.75,4.95 10.05,4.65 10.05,3.38 10.2,3.23 12.97,3.23 13.12,3.38
  pour Top (isolate 0.3, rank 6): 0,0 13.05,0 13.05,30 0,30 0,0.07
  pour Bottom (isolate 0.3, rank 6): 0,0 13.05,0 13.05,30 0,30 0,0.07
CARVIN  (via drill 0.2)
  Top 0.6: X3.1 v4.72,12.75 REG5_C4.1 3.9,9.07 3.6,8.78 RV1.1
  Bottom 0.6: L2.1 v4.72,11.18 v4.72,11.7 v4.72,12.22 v4.72,12.75 4.28,13.2 4.28,16.8 4.72,17.25 X4.1
CARVINFILT  (via drill 0.2)
  Top 0.6: IC8.5 IC8.4 8.97,11 REG5_C6.1 8.1,11.03 7.8,10.72 v7.8,8.47
  Bottom 0.6: L2.2 6.55,7.22 v7.8,8.47 | v7.8,8.47 v7.8,9 v7.8,9.53 v7.8,8.47
CR1
  Top 0.3: QB1.3 28.15,11.55 27.9,11.8 27.9,14.8 26.25,16.45 RP1.2
CR2
  Top 0.3: QB2.3 31.88,11.45 31.68,11.65 31.68,12.68 31,13.35 30.5,13.35 RP2.2
CR3
  Top 0.3: QB3.3 35.6,11.45 35.4,11.65 35.4,14.78 33.75,16.43 RP3.2
CR4
  Top 0.3: QB4.3 39.4,12.3 37.85,13.85 RP4.2
CR5
  Top 0.3: QB5.3 43.15,11.47 42.9,11.72 42.9,14.8 41.25,16.45 RP5.2
CR6
  Top 0.3: QB6.3 46.9,12.45 45.5,13.85 RP6.2
CR7
  Top 0.3: QB7.3 50.62,11.45 50.4,11.68 50.4,14.78 48.75,16.43 RP7.2
CR8
  Top 0.3: QB8.3 54.4,12.3 52.85,13.85 RP8.2
CR9
  Top 0.3: QB9.3 57.9,11.7 57.9,14.78 56.25,16.43 RP9.2
CR10
  Top 0.3: QB10.3 61.9,12.45 60.5,13.85 RP10.2
CR11
  Top 0.3: QB11.3 65.4,11.7 65.4,14.78 63.75,16.43 RP11.2
CR12
  Top 0.3: QB12.3 68.5,9 68.95,9.45 68.95,12.9 68.35,13.5 67.85,13.5 RP12.2
FSM  (via drill 0.2)
  Top 0.15: v49.75,25.65 50.35,25.05 64.15,25.05 66.2,23 R59.1 | v25.2,4.08 25.02,4.08 24.82,4.28 24.82,6.45 20.62,10.65 20.62,10.8 v20.1,11.32
  Bottom 0.15: v49.75,25.65 49.75,26.65 R60.2 48.17,26.75 47.85,27.07 47.85,27.82 47.48,28.2 21.02,28.2 19,26.18 19,12.65 19.88,11.78 19.88,11.55 v20.1,11.32 | v25.2,4.08 IC1.33 27.57,4.08 C4.1
  Bottom 0.2: IC2.29 50.71,24.84 50.7,24.85 50.67,24.82 50.67,26.73 C2.1
  Bottom 0.27: C2.1 R60.2
GND  (via drill 0.2)
  Top 0.15: C23.2 23.25,1.57 23.32,1.65 | C22.2 18.6,4.9 IC1.5 | C14.1 22.18,6.61 Y1.P2 | R11.1 19.88,8.18 20.32,7.72 20.32,6.45 v20.55,6.22 | DT6.C 65.6,16.93 65.55,16.88 65.47,16.88 65.47,19.5 65.1,19.88 v61.88,19.88 | DT5.C 58.02,16.93 57.98,16.88 57.98,19.35 57.6,19.73 57.6,21.25 v58.17,21.82 | DT4.C 50.5,16.93 50.48,16.95 50.48,19.95 50.85,20.32 53.92,20.32 v55.73,22.12 | DT3.C v42.45,16.93 | v34.65,16.95 35.6,16.95 DT2.C | v27.38,16.95 28.1,16.95 DT1.C | X6.11 v29.25,5.78 | DBG1.5 29.02,22.05 29.4,22.43 29.88,22.43 DBG1.3 30.75,22.46 X5.3
  Top 0.3: X6.11 29.25,7.75 | X6.9 32.25,7.67 32.33,7.75 | X6.7 35.25,7.67 35.33,7.75 | X6.5 38.25,7.67 38.17,7.75 | X6.3 41.25,7.75 | X6.1 44.25,7.75 | v23.32,2.17 23.18,2.33 C15.1 23.18,3.61 Y1.P4 | Y1.P2 21.58,6.09 21.45,6.22 v20.55,6.22 | IC5.P$11 18.52,16.75 18.43,16.65 | C34.2 18.82,0.97 18.6,0.75 | C5.2 23.73,20.27 v24.82,21.38 v25.57,21.38 | X5.1 v27.75,24.23 27.75,25.35 29.1,26.7 30.23,26.7 30.75,26.18 | X5.3 30.75,26.18 | X5.5 33.75,25.95 | 33.75,25.95 33,26.7 31.27,26.7 30.75,26.18 | X5.7 36.75,26.02 | 36.75,26.02 36.08,26.7 34.5,26.7 33.75,25.95 | 36.75,26.02 37.42,26.7 39,26.7 39.75,25.95 X5.9 39.75,22.43 39.98,22.2 42.67,22.2 42.75,22.27 X5.11 | 30.52,7.75 v30.52,8.55
  Top 0.4: 18.43,12.65 17.9,11.45 17.85,12.53 17.85,4.58 | 17.85,4.58 17.85,1.5 18.6,0.75 22.57,0.75 23.32,1.5 23.32,1.65 v23.32,2.17 | 17.85,4.58 IC1.5 v19.43,4.58
  Top 0.5: C5.2 23.68,20.23 22.2,21.7 C27.2 21.75,21.95 21.62,21.82 IC5.P$15 18.62,21.82 17.95,21.15 17.95,14.1 | 18.55,13.28 18.1,12.15 18.18,12.75 18.5,12.43 18.43,12.65 | 18.55,13.28 17.95,13.5 17.95,14.1 | IC5.P$9 18.05,14.21 17.95,14.1 | v47.62,6.9 46.77,7.75 44.25,7.75 v42,7.75 41.25,7.75 38.17,7.75 35.33,7.75 32.33,7.75 30.52,7.75 29.25,7.75 28.02,7.75 22.5,13.28 18.55,13.28 | v48.98,27.75 v48.45,27.75 48.45,28.12 48.98,28.12 v48.98,27.75 | X2.P1 48.77,28.7 48.75,28.73 48.75,27.98 v48.98,27.75 | v28.27,27.45 28.27,28.62 28.2,28.7
  Top 0.6: v48.15,6.9 v47.62,6.9
  Top 1.6: 18.43,12.65 18.43,16.65 18.43,27.05 20.07,28.7 X5.P1 28.2,28.7 X5.P2 X2.P1
  Bottom 0.15: 60.42,19.58 60.53,19.58 60.83,19.88 v61.88,19.88 | 55.7,22.65 55.7,22.15 v55.73,22.12 | v42.45,16.93 37.3,16.93 36.83,17.4 35.1,17.4 v34.65,16.95 v27.38,16.95 | v29.25,5.78 29.25,4.72 C4.2 30.07,4.72 C3.2 | 32.17,27.9 29.62,27.9 29.3,27.57 NTC_C3.2 28.4,27.57 v28.27,27.45 | 32.17,27.9 35.25,27.9 | 35.25,27.9 38.17,27.9 | 38.17,27.9 41.25,27.9 | 41.25,27.9 43.92,27.9 NTC_C8.2 | NTC_C5.2 41.25,27.9 | NTC_C1.2 38.25,27.82 38.17,27.9 | NTC_C4.2 35.25,27.9 | NTC_C2.2 32.25,27.82 32.17,27.9
  Bottom 0.27: IC2.40 56.21,22.65 | 52.71,22.65 IC2.33 52.71,25.33 52.88,25.5 53.33,25.5 | IC2.39 55.71,22.66 55.7,22.65 | IC2.38 55.21,22.66 55.2,22.65 | 54.7,22.65 54.71,22.66 IC2.37 54.71,25.39 54.6,25.5 54,25.5 | 54.2,22.65 54.21,22.66 IC2.36 54.21,25.22 53.85,25.57 | 53.7,22.65 53.71,22.66 IC2.35 53.71,25.56 | 53.2,22.65 53.21,22.66 IC2.34 53.21,25.38 53.33,25.5 | IC2.27 49.71,22.65 | 53.33,25.5 53.4,25.57 53.7,25.57 | IC1.41 v23.32,2.17 | IC1.5 v19.43,4.58
  Bottom 0.3: RGQ1_3.1 62.29,23.45 Q2.2 | v20.55,6.22 20.85,6.22 21.15,5.92 21.15,4.28 20.93,4.05 19.95,4.05 v19.43,4.58 | C8.2 38.02,18.07 37.05,19.05 37.05,22.35 36.83,22.57 | 36.83,22.57 IC6.6 | IC6.7 36.85,23.23 | 36.85,23.23 36.98,23.1 36.98,22.73 36.83,22.57 | IC6.8 36.8,23.88 36.98,23.7 36.98,23.35 36.85,23.23 | v27.75,24.23 27.15,24.23 26.48,23.55 26.48,22.27 v25.57,21.38 27.98,21.38 28.73,20.62 28.73,18.3 v27.38,16.95 | NTC_C6.2 NTC_C7.2 NTC_C9.2 NTC_C12.2 NTC_C10.2 NTC_C11.2 30.73,9.05 30.52,8.85 v30.52,8.55 | IC7.8 47.52,1.02 47.85,1.35 47.85,1.8 | 47.85,1.8 47.85,2.33 | 47.85,2.33 47.85,6.67 v47.62,6.9 | IC7.7 47.73,1.68 47.85,1.8 | IC7.6 47.85,2.33 | C9.2 41.98,7.72 v42,7.75
  Bottom 0.5: 49.71,22.65 52.71,22.65 53.2,22.65 53.7,22.65 54.2,22.65 54.7,22.65 55.2,22.65 55.7,22.65 56.21,22.65 57.35,22.65 v58.17,21.82 | v58.17,21.82 60.42,19.58 C1.2 | RGQ1_3.1 60.33,23.45 59.8,23.45 v58.17,21.82 | 53.71,25.56 53.8,25.65 53.8,27.45 53.5,27.75 CVREG.1 CVREF.1 C2.2 R60.1 v48.98,27.75 v48.45,27.75
  Bottom 0.6: 60.5,23.62 60.33,23.45 | V-R.2 v48.15,6.9 v47.62,6.9
  other vias: 43.73,1.05 24.98,12.22 20.55,7.42 21.38,7.42 22.8,2.17 26.93,23.25 26.4,23.25 25.88,23.25 24.68,26.1 25.2,26.1 34.12,26.02 34.12,26.55 37.12,26.02 37.12,26.55 40.2,26.02 40.2,26.55 43.27,26.02 43.27,26.55 46.12,25.95 46.12,26.48 53.92,27 53.92,26.48 53.92,25.95 48,22.8 48.52,22.8 49.05,22.8 49.58,22.8 50.1,22.8 61.65,25.73 59.92,27 60.52,27 61.12,27 61.73,27 18.45,29.25 18.23,0.6 48.38,5.47 48.38,4.95 48.38,4.42
  pour Bottom (isolate 0.25, rank 6): 49.5,8.7 37.35,8.7 36.9,9.15 28.65,9.15 27.75,10.05 27.75,12.6 31.35,16.2 45.6,16.2 45.98,16.57 47.25,17.85 47.25,18.75 48.15,19.65 58.5,19.65 60,18.15 60.83,18.15 60.83,18.65 62,19.82 62,30 18,30 17.77,30 17.77,0 49.5,0
  pour Top (isolate 0.25, rank 6): 49.5,7.28 47.4,7.28 46.8,7.88 30.3,7.88 28.5,9.68 27.3,9.68 24.45,12.53 24.45,19.2 25.05,19.8 30.52,19.8 32.1,21.38 42.38,21.38 43.65,22.65 50.1,22.65 51.9,24.45 62.33,24.45 63.83,25.95 63.83,30 17.77,30 17.77,0 49.5,0
ISP_CAN  (via drill 0.2)
  Top 0.15: R11.2 19.88,10.43 v20.1,10.65
  Bottom 0.15: IC1.14 20.32,10.43 v20.1,10.65
ISP_ENTER  (via drill 0.2)
  Top 0.15: R15.2 20.73,2.52 v20.02,3.23
  Bottom 0.15: IC1.4 19.18,4.08 v20.02,3.23
LED1
  Bottom 0.15: IC1.24 25.32,10.53 23.7,12.15 23.7,15.9 24.3,16.5 24.3,18.98 23.55,19.73 23.55,22.43 24.3,23.18 24.3,24.5 R2.1
LED1C  (via drill 0.2)
  Top 0.2: LED1.C v22.2,24.9
  Bottom 0.2: R2.2 v22.2,24.9
LED2
  Bottom 0.15: IC1.25 26.05,8.07 25.73,8.4 25.73,10.65 24,12.38 24,15.75 24.6,16.35 24.6,19.2 23.85,19.95 23.85,22.27 24.6,23.02 24.6,25.25 R8.1
LED2C  (via drill 0.2)
  Top 0.2: LED2.C 21.45,26.02 21.52,25.95 v22.2,25.95
  Bottom 0.2: R8.2 v22.2,25.95
MISO0  (via drill 0.2)
  Top 0.15: v54.83,27.98 v56.25,27.98
  Bottom 0.15: IC1.27 25.55,7.08 24.15,8.47 19.45,8.47 19.12,8.8 19.12,10.5 19.27,10.65 19.27,11.4 18.38,12.3 18.38,26.48 20.7,28.8 54,28.8 v54.83,27.98 | R19.1 59.1,24.64 59.1,23.7 58.35,22.95 57.98,22.95 57.71,23.22 IC2.43 57.71,26.52 v56.25,27.98
MOSI0
  Bottom 0.15: IC1.28 25.6,6.58 24,8.18 19.3,8.18 18.82,8.65 18.82,10.65 18.98,10.8 18.98,11.25 18.07,12.15 18.07,26.62 20.55,29.1 54.38,29.1 57.21,26.27 IC2.42
N$2  (via drill 0.2)
  Top 0.3: L12.1 10.57,26.45 v10.57,26.43
  Bottom 0.3: IC4.7 v10.57,26.44 v10.57,26.43
N$6  (via drill 0.2)
  Top 0.3: L12.2 10.65,27.7 v10.65,27.68
  Bottom 0.3: IC4.6 10.65,27.71 v10.65,27.68
Q1G
  Bottom 0.3: Q1.1 64.99,18.86 RGQ1_1.2 68.69,18.86 D2.A 68.89,22.15 RGQ1_2.2
Q1GR
  Bottom 0.3: Q2.3 66.65,22.89 RGQ1_2.1
QBG1  (via drill 0.2)
  Top 0.25: QB1.1 v29.45,10.5
  Bottom 0.25: RBG1.1 v29.45,10.5
QBG2  (via drill 0.2)
  Top 0.25: QB2.1 v33.2,10.5
  Bottom 0.25: RBG2.1 v33.2,10.5
QBG3  (via drill 0.2)
  Top 0.25: QB3.1 v36.95,10.5
  Bottom 0.25: RBG3.1 v36.95,10.5
QBG4  (via drill 0.2)
  Top 0.25: QB4.1 v40.7,10.5
  Bottom 0.25: RBG4.1 v40.7,10.5
QBG5  (via drill 0.2)
  Top 0.25: QB5.1 v44.45,10.5
  Bottom 0.25: RBG5.1 v44.45,10.5
QBG6  (via drill 0.2)
  Top 0.25: QB6.1 v48.2,10.5
  Bottom 0.25: RBG6.1 v48.2,10.5
QBG7  (via drill 0.2)
  Top 0.25: QB7.1 v51.95,10.5
  Bottom 0.25: RBG7.1 v51.95,10.5
QBG8  (via drill 0.2)
  Top 0.25: QB8.1 v55.7,10.5
  Bottom 0.25: RBG8.1 v55.7,10.5
QBG9  (via drill 0.2)
  Top 0.25: QB9.1 v59.45,10.5
  Bottom 0.25: RBG9.1 v59.45,10.5
QBG10  (via drill 0.2)
  Top 0.25: QB10.1 v63.2,10.5
  Bottom 0.25: RBG10.1 v63.2,10.5
QBG11  (via drill 0.2)
  Top 0.25: QB11.1 v66.95,10.5
  Bottom 0.25: RBG11.1 66.65,10.8 v66.95,10.5
QBG12  (via drill 0.2)
  Top 0.15: QB12.1 v67.25,7.5
  Bottom 0.15: RBG12.1 68.15,11.4 68.45,11.1 68.45,7.95 QB12.1 v67.25,7.5
RS1
  Bottom 0.15: R39.1 11.77,22.95 12.33,23.51 IC4.8
SCK0
  Bottom 0.15: IC1.22 24.32,8.95 24.15,8.78 19.6,8.78 19.43,8.95 19.43,10.35 19.57,10.5 19.57,11.55 18.68,12.45 18.68,26.32 20.85,28.5 53.55,28.5 56.71,25.34 IC2.41
SSEL0  (via drill 0.2)
  Top 0.15: v18.45,11.1 18.45,7.92 v19.3,7.08
  Bottom 0.15: v18.45,11.1 17.77,11.78 17.77,26.82 20.35,29.4 55.65,29.4 58.21,26.84 IC2.44 | IC1.10 v19.3,7.08
SW1  (via drill 0.2)
  Bottom 0.2: REG5_C2.2 v7.88,7.5
  pour Top (rank 5, no thermals): 8.62,7.72 9.32,7.72 9.32,4.62 9.6,4.35 9.6,3.6 9.45,3.45 6.6,3.45 6.45,3.6 6.45,6.38 7.8,7.72
SWCLK  (via drill 0.2)
  Top 0.15: DBG1.4 30.3,20.7 29.62,20.02 v27.15,20.02
  Bottom 0.15: v27.15,20.02 27.15,18 26.32,17.18 26.32,9.97 27.23,9.07 28.43,9.07 28.73,8.78 28.73,6.45 28.35,6.08 IC1.29
SWDIO  (via drill 0.2)
  Top 0.15: DBG1.2 31.54,20.74 30.45,19.65 28.35,19.65 v28.12,19.43
  Bottom 0.15: IC1.39 24.32,1.75 24.45,1.88 25.57,1.88 26.7,0.75 30.3,0.75 30.9,1.35 30.9,4.8 29.02,6.67 29.02,8.93 28.57,9.38 27.38,9.38 26.62,10.12 26.62,16.95 28.12,18.45 v28.12,19.43
TEMP0  (via drill 0.2)
  Top 0.15: v29.25,25.95 X5.2 29.25,23.1 29.18,23.02 v28.57,23.02
  Bottom 0.15: v29.25,25.95 NTC_C3.1 30.12,26.57 NTC_R3.1 | IC6.1 32.27,19.32 v28.57,23.02
TEMP1  (via drill 0.2)
  Top 0.15: v32.25,25.95 X5.4 v32.85,23.25
  Bottom 0.15: v32.25,25.95 NTC_C2.1 32.27,26.6 NTC_R2.1 | IC6.5 34.92,21.93 33.6,23.25 v32.85,23.25
TEMP2  (via drill 0.2)
  Top 0.15: v35.25,25.95 X5.6 35.25,20.7 34.88,20.32 v34.5,20.32
  Bottom 0.15: v35.25,25.95 NTC_C4.1 36.12,26.57 NTC_R4.1 | IC6.2 34.85,19.98 v34.5,20.32
TEMP3  (via drill 0.2)
  Top 0.15: v38.25,25.95 X5.8 38.17,23.18 v38.85,23.18
  Bottom 0.15: v38.25,25.95 NTC_C1.1 39.12,26.57 NTC_R1.1 | IC6.12 39.65,21.93 38.85,22.73 v38.85,23.18
TEMP4  (via drill 0.2)
  Top 0.15: X5.10 41.25,24.75 v41.25,25.95
  Top 0.3: v43.05,24.75 41.25,24.75
  Bottom 0.15: v41.25,25.95 NTC_C5.1 42.12,26.57 NTC_R5.1 | IC6.14 42.15,20.62 42.6,21.07 43.15,21.62 43.15,24.65 v43.05,24.75
TEMP5  (via drill 0.2)
  Top 0.15: X5.12 44.25,24.23 v44.25,25.95
  Top 0.3: 44.25,24.23 v43.73,24.23
  Bottom 0.15: v44.25,25.95 NTC_C8.1 45.12,26.57 NTC_R8.1 | IC6.15 42.48,19.98 43.12,20.55 43.73,21.15 v43.73,24.23
TEMP6  (via drill 0.2)
  Top 0.15: v43.2,5.78 42.75,6.22 X6.2 42.75,6.53 42,5.78 40.05,5.78 v39.75,5.47
  Bottom 0.15: IC7.1 43.4,5.58 v43.2,5.78 | NTC_C6.1 38.23,8.05 39.75,6.53 v39.75,5.47 39.08,5.47 38.17,4.58 38.17,3.12 NTC_R6.1
TEMP7  (via drill 0.2)
  Top 0.15: X6.4 39.75,6.22 38.92,5.4 | 38.92,5.4 v36.83,5.4 | v45.83,2.98 45.83,4.42 45.15,5.1 40.65,5.1 40.5,4.95 39.23,4.95 38.92,5.25 38.92,5.4
  Bottom 0.15: NTC_C7.1 35.55,6.67 v36.83,5.4 37.65,4.58 37.65,2.7 38.25,2.1 NTC_R7.1 | IC7.5 v45.83,2.98
TEMP8  (via drill 0.2)
  Top 0.15: X6.6 36.75,6.53 35.7,5.47 | 35.7,5.47 v35.1,5.47 | v45,4.58 36.6,4.58 35.7,5.47
  Bottom 0.15: NTC_C9.1 34.5,6.08 v35.1,5.47 37.27,3.3 NTC_R9.1 | IC7.2 45.35,4.92 v45,4.58
TEMP9  (via drill 0.2)
  Top 0.15: X6.8 v33.75,5.47 | v36.3,3.38 36.38,3.38 36.6,3.15 39.83,3.15 v40.05,3.38
  Bottom 0.15: NTC_C12.1 33.45,7.05 X6.8 v33.75,5.47 34.2,5.47 v36.3,3.38 NTC_R12.1 | IC7.12 40.45,2.98 v40.05,3.38
TEMP10  (via drill 0.2)
  Top 0.15: X6.10 30.75,6.6 31.35,6 32.4,6 v32.92,5.47 | v35.33,3.52 35.7,3.9 36.52,3.9 36.98,3.45 39.15,3.45 v39.6,3.9
  Bottom 0.15: NTC_C10.1 32.4,6 v32.92,5.47 34.88,3.52 v35.33,3.52 NTC_R10.1 | IC7.14 39.98,4.28 v39.6,3.9
TEMP11  (via drill 0.2)
  Top 0.15: X6.12 27.75,6.15 28.73,5.17 31.65,5.17 v31.95,5.47 33.23,4.2 38.55,4.2 v38.77,3.98
  Bottom 0.15: NTC_C11.1 31.35,6.08 v31.95,5.47 33.23,4.2 33.67,4.2 34.35,3.52 NTC_R11.1 | IC7.15 39.73,4.92 v38.77,3.98
TEMPR  (via drill 0.2)
  Top 0.15: DT6.A 65.62,15.68 66.15,16.2 66.15,17.32 65.85,17.62 65.85,20.4 65.4,20.85 v60.9,20.85 | DT5.A 58.12,15.68 58.65,16.2 58.65,17.32 58.35,17.62 58.35,19.73 v58.5,19.88 58.5,21.23 v59.1,21.82 | DT4.A 50.62,15.68 51.15,16.2 51.15,17.32 50.85,17.62 50.85,19.65 v51,19.8 | DT1.A 28.12,15.68 v28.88,16.43 | DT2.A 35.65,15.78 v36.6,16.73 | DT3.A 43.12,15.68 v44.1,16.65 44.1,16.88 43.35,17.62 43.35,19.43 44.55,20.62 v47.33,20.62 | v27.98,3.6 28.5,4.12 30.68,4.12 v31.43,3.38 v33.75,3.38
  Bottom 0.15: v44.1,16.65 43.88,16.43 36.9,16.43 v36.6,16.73 36.3,16.43 v28.88,16.43 28.88,15.07 26.93,13.12 26.93,10.28 27.52,9.68 28.73,9.68 29.32,9.07 29.32,6.83 31.43,4.72 v31.43,3.38 | v47.33,20.62 50.17,20.62 v51,19.8 51.45,19.35 57.98,19.35 v58.5,19.88 | v60.9,20.85 60.08,20.85 v59.1,21.82 | IC1.34 27.95,3.58 v27.98,3.6 28.5,4.12 29.1,4.12 29.7,3.52 C3.1 | R9.1 32.85,3.38 v33.75,3.38
TS0  (via drill 0.2)
  Top 0.15: v22.2,10.65 22.2,10.5 26.18,6.53 26.18,4.12 27.6,2.7 30.38,2.7 30.82,2.25 39.48,2.25 v40.05,1.68
  Bottom 0.15: IC1.18 22.32,10.53 v22.2,10.65 21.68,11.18 21.68,11.4 21.38,11.7 21.38,12.3 21.07,12.6 21.07,14.93 20.93,15.07 20.93,26.1 21.82,27 25.57,27 26.4,26.18 27.68,26.18 29.25,24.6 41.92,24.6 42.45,24.07 42.45,23.48 42.2,23.23 IC6.10 | IC7.10 v40.05,1.68
TS1  (via drill 0.2)
  Top 0.15: v22.2,11.4 23.18,11.4 v23.93,10.65 23.93,9.22 26.48,6.67 26.48,4.28 27.75,3 30.52,3 30.98,2.55 40.73,2.55 v41.92,1.35
  Bottom 0.15: IC1.21 23.82,10.55 v23.93,10.65 | v22.2,11.4 22.12,11.4 21.68,11.85 21.68,12.45 21.38,12.75 21.38,15.07 21.23,15.22 21.23,25.95 21.98,26.7 25.43,26.7 26.25,25.88 27.52,25.88 29.1,24.3 39.83,24.3 40.25,23.88 IC6.9 | IC7.9 41.6,1.02 v41.92,1.35
UCT1  (via drill 0.2)
  Top 0.15: v25.65,5.58 25.55,5.58 25.43,5.7 25.43,6.75 21.3,10.88 21.3,11.78 21,12.07 v20.77,12.07 | v26.85,26.7 v26.85,25.35
  Bottom 0.15: IC1.30 v25.65,5.58 | v20.77,12.07 20.55,12.3 20.55,26.32 21.68,27.45 26.1,27.45 v26.85,26.7 | v26.85,25.35 27.52,25.35 28.95,23.93 30,23.93 31.43,22.5 33.23,22.5 35.1,20.62 IC6.3
UCT2  (via drill 0.2)
  Top 0.15: v25.65,4.58 25.12,5.1 25.12,6.6 20.93,10.8 20.93,11.18 v20.77,11.32
  Bottom 0.15: IC1.32 v25.65,4.58 | v20.77,11.32 20.25,11.85 20.25,26.48 21.52,27.75 26.62,27.75 29.48,24.9 42.15,24.9 42.83,24.23 42.83,21.98 42.12,21.27 IC6.13
UCT3  (via drill 0.2)
  Top 0.15: v28.73,3.52 30.45,3.52 31.12,2.85 44.17,2.85 v44.85,2.17
  Bottom 0.15: IC1.35 28.27,3.08 v28.73,3.52 | IC7.3 45.83,4.28 44.85,3.3 v44.85,2.17
UCT4  (via drill 0.2)
  Top 0.15: v28.35,1.27 28.5,1.12 31.73,1.12 32.17,1.57 39.3,1.57 40.05,0.82 42.38,0.82 42.6,1.05 42.6,1.65 v42,2.25
  Bottom 0.15: IC1.40 23.82,1.85 24.23,2.25 25.65,2.25 26.62,1.27 v28.35,1.27 | IC7.13 41.83,3.62 42,3.45 v42,2.25
V+  (via drill 0.2)
  Top 0.15: v67.9,20.55 67.9,22.95 R59.2
  Bottom 0.15: Q1.3 62.76,19.76 63.1,20.1 67.45,20.1 v67.9,20.55
  Bottom 0.3: IC2.1 58.29,16.89 C1.1 62.09,16.89 62.76,17.56 Q1.3
V+S
  Bottom 0.3: V+R.2 63.87,5.02 65.15,6.3 68.75,6.3 69.5,7.05 69.5,16.4 D2.C 68.54,17.36 RGQ1_1.1 65.47,17.36 Q1.2
  Bottom 0.6: D1.C 54.23,6.87 56.08,5.02 V+R.2
VREF
  Bottom 0.2: IC2.31 51.71,26.66 CVREF.2
VREG
  Bottom 0.2: IC2.32 52.21,25.96 CVREG.2
XTALIN  (via drill 0.2)
  Top 0.15: Y1.P3 21.5,4.63 21.52,4.65 | v20.55,4.65 21.3,4.65 Y1.P3 | Y1.P3 21.81,4.29 21.98,4.12 21.98,3.45 C15.2
  Bottom 0.15: IC1.6 20.12,5.08 v20.55,4.65
XTALOUT  (via drill 0.2)
  Top 0.15: v20.55,5.55 20.85,5.25 22.88,5.25 23.72,6.09 Y1.P1 23.18,6.77 C14.2
  Bottom 0.15: IC1.7 20.52,5.58 v20.55,5.55

## Text on the board
bValues: WE-TVS
Document: T1 | T2 | GND | T3 | T4 | C1 | C3 | C5 | C7 | C9 | C11 | GND | CANH | CANL | 12V | C0 | C2 | C4 | C6 | C8 | C10 | C12
_tsilk: 12V | HV | c David Brandt / uniworse.org/bms | canSlaveV06
_bsilk: canSlaveV06 | 12V | HV | c David Brandt / uniworse.org/bms